# EAGLE schematic v1 (EAGLE 6.5.0)
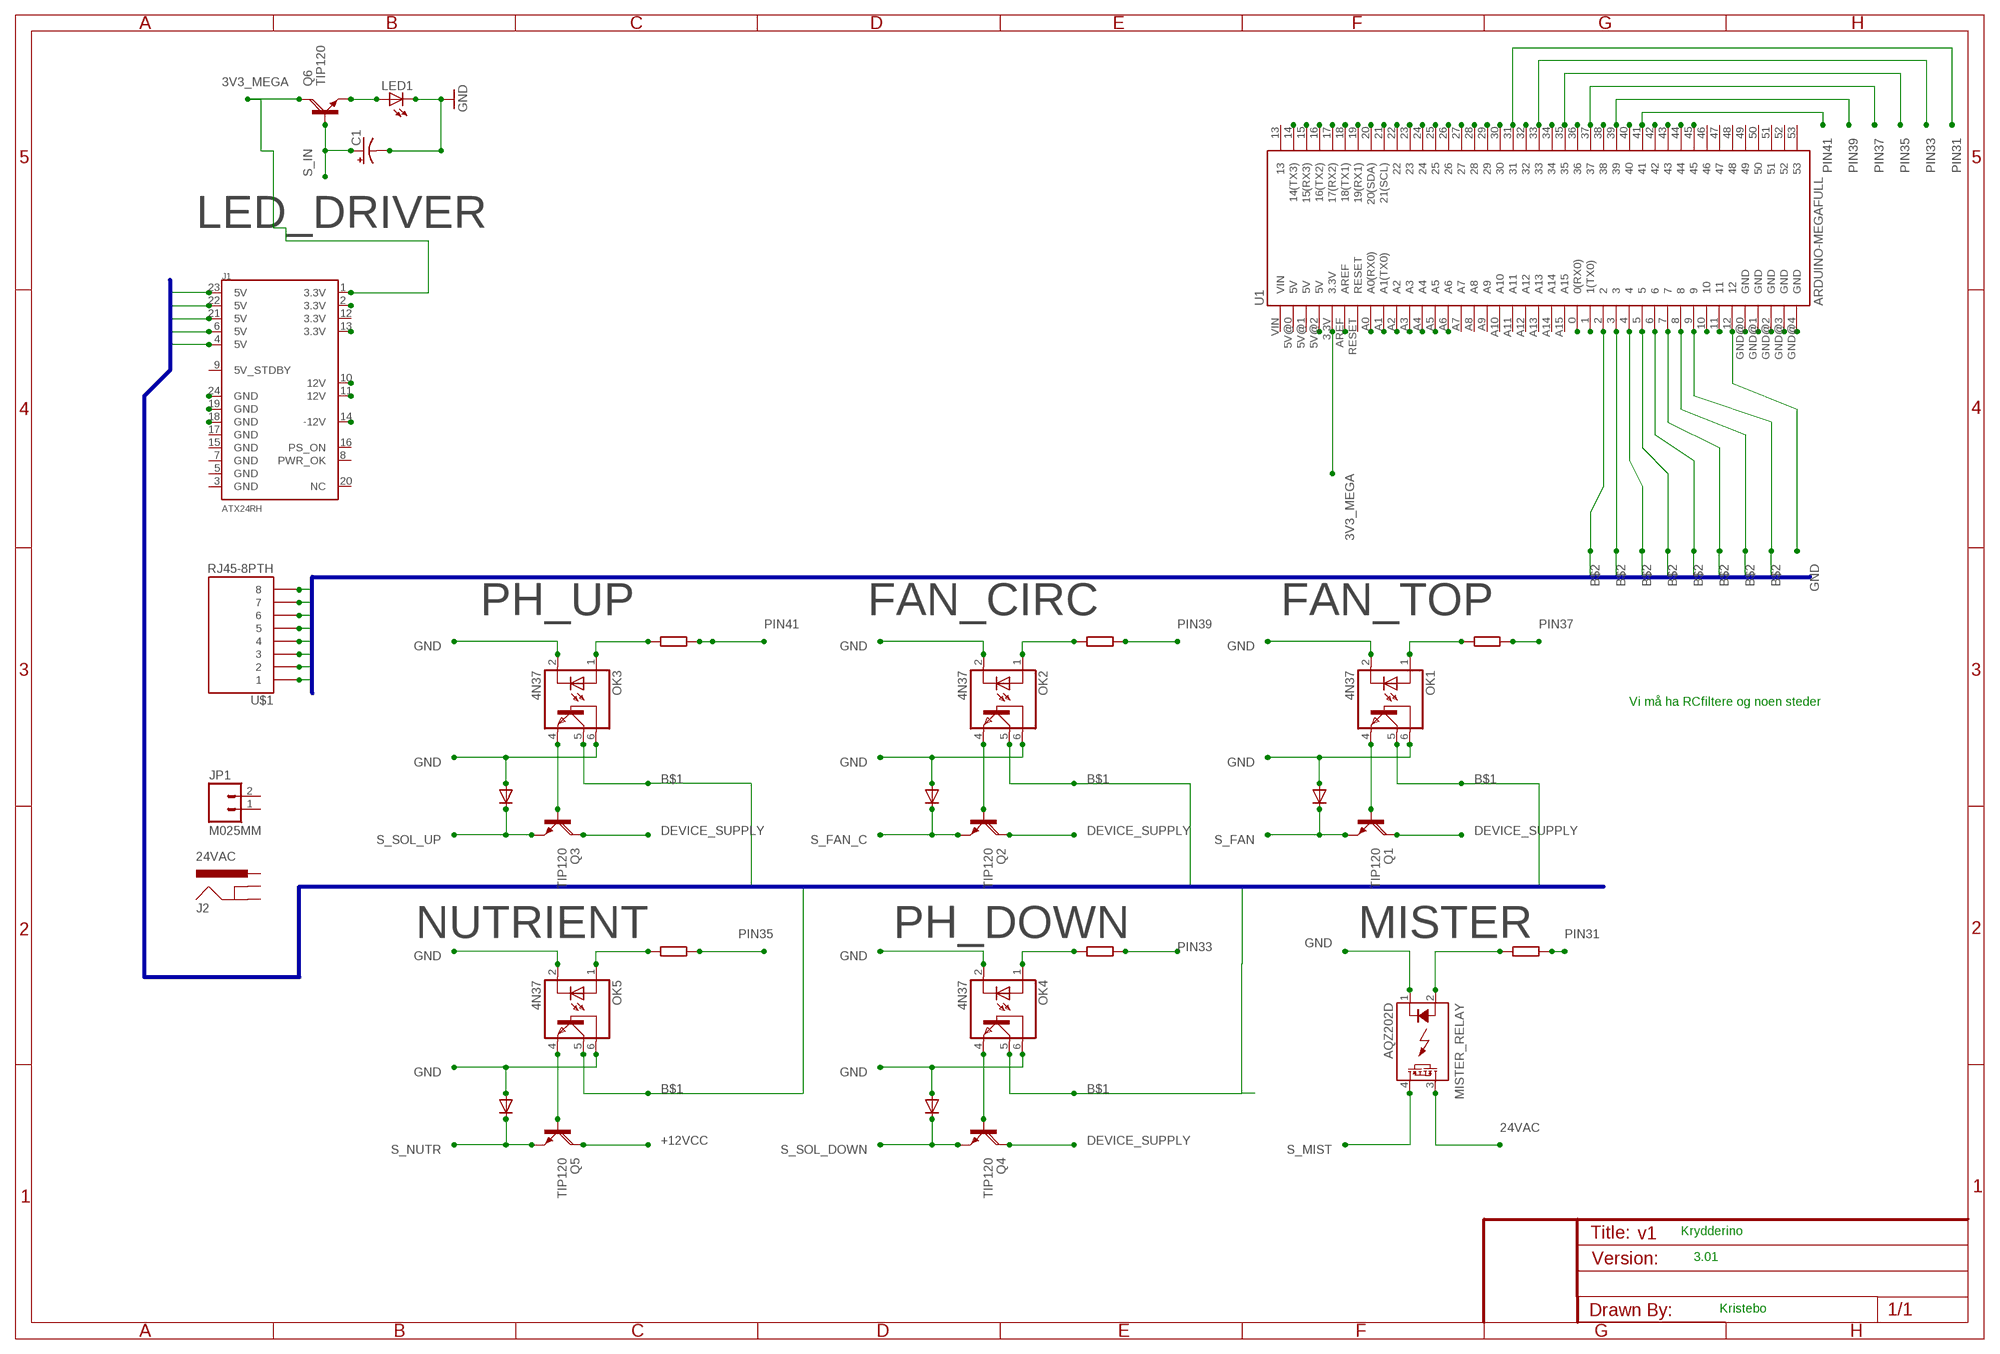
[diagram p0: schematic, sheet 1]

## Parts
C1  CAP_POLPTH1  [CPOL-RADIAL-100UF-25V]
J1  ATX24RH  [ATX24_RIGHT_ANGLE]
J2  24VAC  POWER_JACKSLT  [POWER_JACK_SLOT]
JP1  M025MM  [SCREWTERMINAL-5MM-2]
LED1  LED3MM  [LED3MM]
MISTER_RELAY  AQZ202D  [AQZ-SIL04]
OK1  4N37  [DIL06]
OK2  4N37  [DIL06]
OK3  4N37  [DIL06]
OK4  4N37  [DIL06]
OK5  4N37  [DIL06]
Q1  TIP120  [TO220AH]
Q2  TIP120  [TO220AH]
Q3  TIP120  [TO220AH]
Q4  TIP120  [TO220AH]
Q5  TIP120  [TO220AH]
Q6  TIP120  [TO220AH]
U1  ARDUINO-MEGAFULL  [ARDUINO_MEGA]
U$1  RJ45-8PTH  [RJ45-8]

## Nets
3V3_MEGA: J1.1(3.3V) Q6.C U1.3.3V
24VAC: MISTER_RELAY.3(DS1)
+12VCC: Q5.C
B$1: J1.4(5V) J1.6(5V) J1.21(5V) J1.22(5V) J1.23(5V) OK1.5(COL) OK2.5(COL) OK3.5(COL) OK4.5(COL) OK5.5(COL)
B$2: U1.2 U1.3 U1.4 U1.5 U1.6 U1.7 U1.8 U1.9 U$1.1 U$1.2 U$1.3 U$1.4 U$1.5 U$1.6 U$1.7 U$1.8
DEVICE_SUPPLY: Q1.C Q2.C Q3.C Q4.C
GND: C1.2(-) LED1.K(C) MISTER_RELAY.1(K) OK1.2(C) OK1.6(BAS) OK2.2(C) OK2.6(BAS) OK3.2(C) OK3.6(BAS) OK4.2(C) OK4.6(BAS) OK5.2(C) OK5.6(BAS) U1.12
N$1: OK1.4(EMI) Q1.B
N$2: LED1.A Q6.E
N$3: J1.24(GND)
N$4: U1.A0(A0(RX0))
N$5: J1.19(GND)
N$6: J1.18(GND)
N$7: U1.22
N$8: U1.5V@2(5V)
N$9: OK2.4(EMI) Q2.B
N$10: U1.24
N$11: U1.23
N$12: OK3.4(EMI) Q3.B
N$13: U1.25
N$14: U1.26
N$15: OK4.4(EMI) Q4.B
N$16: U1.27
N$17: U1.28
N$18: OK5.4(EMI) Q5.B
N$20: U1.10
N$21: U1.11
N$22: U1.A1(A1(TX0))
N$23: U1.A2
N$24: U1.A3
N$25: U1.A4
N$26: U1.A5
N$27: U1.A6
N$28: U1.30
N$30: U1.32
N$31: U1.14(14(TX3))
N$32: U1.34
N$33: U1.15(15(RX3))
N$34: U1.36
N$35: U1.16(16(TX2))
N$36: U1.38
N$37: U1.17(17(RX2))
N$38: U1.40
N$39: U1.18(18(TX1))
N$40: U1.42
N$41: U1.43
N$42: U1.44
N$43: U1.45
N$44: U1.19(19(RX1))
N$45: U1.20(20(SDA))
N$46: U1.21(21(SCL))
N$47: U1.29
N$48: U1.GND@0(GND)
N$49: U1.GND@1(GND)
N$50: U1.GND@3(GND)
N$51: U1.GND@2(GND)
N$52: U1.GND@4(GND)
N$53: U1.0(0(RX0))
N$54: U1.1(1(TX0))
N$55: U1.AREF
N$60: J1.2(3.3V)
N$61: J1.13(3.3V)
N$62: J1.10(12V)
N$63: J1.11(12V)
N$64: J1.14(-12V)
PIN31: OK1.1(A) U1.31
PIN33: OK2.1(A) U1.33
PIN35: OK3.1(A) U1.35
PIN37: OK4.1(A) U1.37
PIN39: OK5.1(A) U1.39
PIN41: MISTER_RELAY.2(A) U1.41
S_FAN: Q1.E
S_FAN_C: Q2.E
S_IN: C1.1(+) Q6.B
S_MIST: MISTER_RELAY.4(DS2)
S_NUTR: Q5.E
S_SOL_DOWN: Q4.E
S_SOL_UP: Q3.E
Unconnected: J1.3(GND) J1.5(GND) J1.7(GND) J1.8(PWR_OK) J1.9(5V_STDBY) J1.12(3.3V) J1.15(GND) J1.16(PS_ON) J1.17(GND) J1.20(NC) J2.GND@1(GNDBREAK) J2.GND@2(GND) J2.PWR JP1.1 JP1.2 U1.5V@0(5V) U1.5V@1(5V) U1.13 U1.46 U1.47 U1.48 U1.49 U1.50 U1.51 U1.52 U1.53 U1.A7 U1.A8 U1.A9 U1.A10 U1.A11 U1.A12 U1.A13 U1.A14 U1.A15 U1.RESET U1.VIN

## Buses
B$1
B$2

## Notes on the sheet
- LED_DRIVER
- PH_UP | FAN_CIRC | FAN_TOP
- Vi må ha RCfiltere og noen steder
- NUTRIENT | PH_DOWN | MISTER
- Krydderino
- 3.01
- Kristebo

## Library data of the parts
C1 = SparkFun-Capacitors:CAP_POL: Capacitor Polarized These are standard SMD and PTH capacitors. Normally 10uF, 47uF, and 100uF in electrolytic and tantalum varieties. Always verify the external diameter of the through hole cap, it varies with capacity, voltage, and manufacturer. The EIA devices should be standard.
J1 = SparkFun-Connectors:ATX24: ATX24 Pin Power Supply Connector This is a good connector for connecting a computer power supply to a PCB. It's massive, but provides many amps of power at 5V and 12V. SKU: PRT-09498
J2 = SparkFun-Connectors:POWER_JACK: Power Jack This is the standard 5.5mm barrel jack for power. The PTH is the most common, proven, reliable, footprint. The Slot footprint only works if the mill layer is transmitted to the PCB fab house so be warned. Spark Fun Electronics SKU : PRT-00119 SMT: CONN-08106 Mating wall wart : TOL-00298 (and others)
JP1 = SparkFun-Connectors:M02: Standard 2-pin 0.1" header. Use with - straight break away headers ( PRT-00116) - right angle break away headers (PRT-00553) - swiss pins (PRT-00743) - machine pins (PRT-00117) - female headers (PRT-00115) Molex polarized connector foot print use with: PRT-08233 with associated crimp pins and housings. 2.54_SCREWTERM for use with PRT-10571. 3.5mm Screw Terminal footprints for PRT-08084 5mm Screw Terminal footprints for use with PRT-08433
LED1 = led:LED: LED OSRAM: - CHIPLED LG R971, LG N971, LY N971, LG Q971, LY Q971, LO R971, LY R971 LH N974, LH R974 LS Q976, LO Q976, LY Q976 LO Q996 - Hyper CHIPLED LW Q18S LB Q993, LB Q99A, LB R99A - SideLED LS A670, LO A670, LY A670, LG A670, LP A670 LB A673, LV A673, LT A673, LW A673 LH A674 LY A675 LS A676, LA A676, LO A676, LY A676, LW A676 LS A679, LY A679, LG A679 - Hyper Micro SIDELED® LS Y876, LA Y876, LO Y876, LY Y876 LT Y87S - SmartLED LW L88C, LW L88S LB L89C, LB L89S, LG L890 LS L89K, LO L89K, LY L89K LS L896, LA L896, LO L896, LY L896 - TOPLED LS T670, LO T670, LY T670, LG T670, LP T670 LSG T670, LSP T670, LSY T670, LOP T670, LYG T670 LG T671, LOG T671, LSG T671 LB T673, LV T673, LT T673, LW T673 LH T674 LS T676, LA T676, LO T676, LY T676, LB T676, LH T676, LSB T676, LW T676 LB T67C, LV T67C, LT T67C, LS T67K, LO T67K, LY T67K, LW E67C LS E67B, LA E67B, LO E67B, LY E67B, LB E67C, LV E67C, LT E67C LW T67C LS T679, LY T679, LG T679 LS T770, LO T770, LY T770, LG T770, LP T770 LB T773, LV T773, LT T773, LW T773 LH T774 LS E675, LA E675, LY E675, LS T675 LS T776, LA T776, LO T776, LY T776, LB T776 LHGB T686 LT T68C, LB T68C - Hyper Mini TOPLED® LB M676 - Mini TOPLED Santana® LG M470 LS M47K, LO M47K, LY M47K Source: http://www.osram.convergy.de LUXEON: - LUMILED® LXK2-PW12-R00, LXK2-PW12-S00, LXK2-PW14-U00, LXK2-PW14-V00 LXK2-PM12-R00, LXK2-PM12-S00, LXK2-PM14-U00 LXK2-PE12-Q00, LXK2-PE12-R00, LXK2-PE12-S00, LXK2-PE14-T00, LXK2-PE14-U00 LXK2-PB12-K00, LXK2-PB12-L00, LXK2-PB12-M00, LXK2-PB14-N00, LXK2-PB14-P00, LXK2-PB14-Q00 LXK2-PR12-L00, LXK2-PR12-M00, LXK2-PR14-Q00, LXK2-PR14-R00 LXK2-PD12-Q00, LXK2-PD12-R00, LXK2-PD12-S00 LXK2-PH12-R00, LXK2-PH12-S00 LXK2-PL12-P00, LXK2-PL12-Q00, LXK2-PL12-R00 Source: www.luxeon.com KINGBRIGHT: KA-3528ASYC Source: www.kingbright.com
MISTER_RELAY = relay:AQZ20*D: PhotoMOS Relay NAiS Source: http://www.panasonic-electric-works.com/catalogues/downloads/photomos/ds_x615_en_aqz10_20.pdf; MF: AROMAT/ MATSUSHITA; MPN: AQZ202D; OC_FARNELL: 2053925; OC_NEWARK: 10C4043
OK1-OK5 = optocoupler:4N37: OPTO COUPLER Source: http://www.fairchildsemi.com/pf/4N/4N35-M.html; MF: FAIRCHILD SEMICONDUCTOR; MPN: 4N37; OC_FARNELL: 1612456; OC_NEWARK: 72K9948
Q1-Q6 = transistor-power:TIP120: NPN DARLINGTON TRANSISTOR
U1 = SparkFun-Boards:ARDUINO-MEGA: Arduino Mega board footprint
U$1 = SparkFun-Connectors:RJ45-8: RJ45 Jack Simple RJ45, 8-pin connection - connector for common Cat5, Cat5e, and Cat6 Ethernet cables. Footprint not yet proven in production. Connector sku is PRT-00643; Breakout PCB sku is BOB-00716.